# EAGLE design cpu3.5e2 (EAGLE 7.3.0)

## Sheet 1 of 2
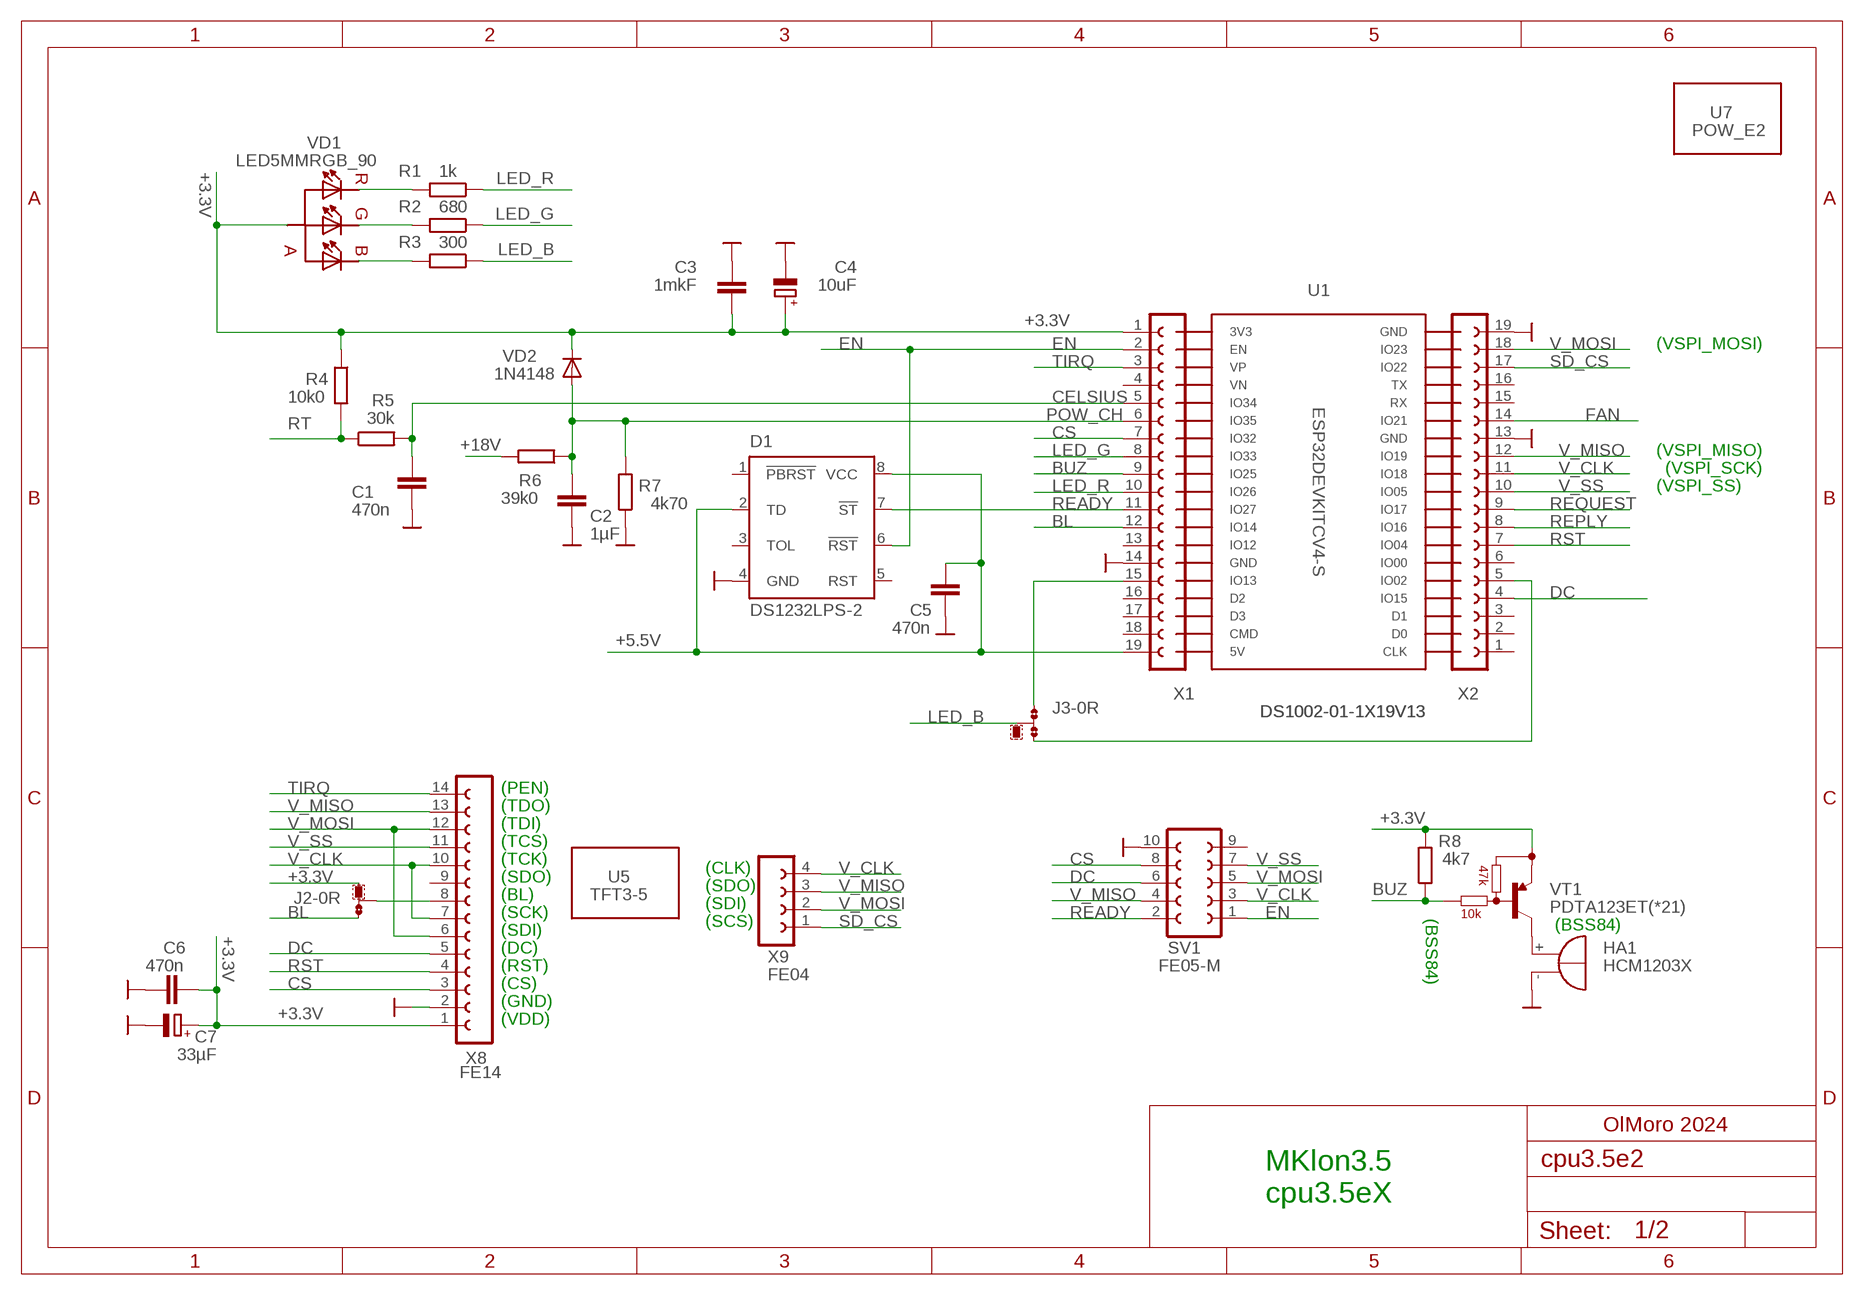
[diagram p0: schematic, sheet 1]

### Parts
C1  470n  C-EUC0805  [C0805]
C2  1µF  C-EUC0805  [C0805]
C3  1mkF  C-EUC0805  [C0805]
C4  10uF  CPOL-EUCT3528  [CT3528]
C5  470n  C-EUC0805  [C0805]
C6  470n  C-EUC0805  [C0805]
C7  33µF  CPOL-EUCT6032  [CT6032]
D1  DS1232LPS-2  [SO-08]
HA1  HCM1203X  BMT1205XH7.5  [BMT1205XH7.5]
J2  0R-JUMPB  [B0R-JMP]
J3  0R-JUMPB  [B0R-JMP]
R1  1k  R-EU_R0805  [R0805]
R2  680  R-EU_R0805  [R0805]
R3  300  R-EU_R0805  [R0805]
R4  10k0  R-EU_R0805  [R0805]
R5  30k  R-EU_R0805  [R0805]
R6  39k0  R-EU_R0805  [R0805]
R7  4k70  R-EU_R0805  [R0805]
R8  4k7  R-EU_R0805  [R0805]
SV1  FE05-M  [FE05-2M]
U1  ESP32DEVKITCV4-S  [ESP32DEVKITCV4-S]
U5  TFT3-5  [TFT3-5]
U7  POW_E2  POW3_5  [POW3_5]
VD1  LED5MMRGB_90  [LED5MMRGB_90]
VD2  1N4148  DIODE-MINIMELF  [MINIMELF]
VT1  PDTA123ET(*21)  BCR185  [SOT23-BEC]
X1  DS1002-01-1X19V13  [DS1002-01-1X19V13]
X2  DS1002-01-1X19V13  [DS1002-01-1X19V13]
X8  FE14  [FE14]
X9  FE04  [FE04]

### Nets
+3.3V: C3.1 C4.+ C6.1 C7.+ J2.1 R4.1 R8.2 VD1.P$3(A) VD2.C VT1.E X1.1 X8.1
+5.5V: C5.1 D1.2(TD) D1.8(VCC) X1.19 ; also sheet 2
+18V: R6.2 ; also sheet 2
BL: J2.3 X1.12
BUZ: R8.1 VT1.B X1.9
CELSIUS: C1.1 R5.2 X1.5
CS: SV1.8 X1.7 X8.3
DC: SV1.6 X2.4 X8.5
EN: D1.6(!RST) SV1.1 X1.2 ; also sheet 2
FAN: X2.14 ; also sheet 2
GND: C1.2 C2.2 C3.2 C4.- C5.2 C6.2 C7.- D1.4(GND) HA1.- R7.1 SV1.10 X1.14 X2.13 X2.19 X8.2 ; supply symbol labelled  ; also sheet 2
LED_B: J3.2 J3.3 R3.1 X1.15
LED_G: R2.1 X1.8
LED_R: R1.1 X1.10
N$1: J2.2 X8.8
N$3: J3.1 X2.5
N$14: HA1.+ VT1.C
N$39: R2.2 VD1.P$2(GREEN)
N$40: R1.2 VD1.P$4(RED)
N$44: R3.2 VD1.P$1(BLUE)
POW_CH: C2.1 R6.1 R7.2 VD2.A X1.6
READY: D1.7(!ST) SV1.2 X1.11 ; also sheet 2
REPLY: X2.8 ; also sheet 2
REQUEST: X2.9 ; also sheet 2
RST: X2.7 X8.4
RT: R4.2 R5.1 ; also sheet 2
SD_CS: X2.17 X9.1
TIRQ: X1.3 X8.14
V_CLK: SV1.3 X2.11 X8.7 X8.10 X9.4
V_MISO: SV1.4 X2.12 X8.13 X9.3
V_MOSI: SV1.5 X2.18 X8.6 X8.12 X9.2
V_SS: SV1.7 X2.10 X8.11
Unconnected: D1.1(!PBRST) D1.3(TOL) D1.5(RST) SV1.9 X1.4 X1.13 X1.16 X1.17 X1.18 X2.1 X2.2 X2.3 X2.6 X2.15 X2.16 X8.9

### Notes on the sheet
- (VSPI_MOSI)
- (VSPI_MISO)
- (VSPI_SCK)
- (VSPI_SS)
- (PEN)
- (TDO)
- (TDI)
- (TCS)
- (TCK)
- (CLK)
- (SDO)
- (SDO)
- (BL)
- (SDI)
- (SCK) | (BSS84) | (BSS84)
- (SCS)
- (SDI)
- (DC)
- (RST)
- (CS)
- (GND)
- (VDD)
- OlMoro 2024
- MKlon3.5
  cpu3.5eX

## Sheet 2 of 2
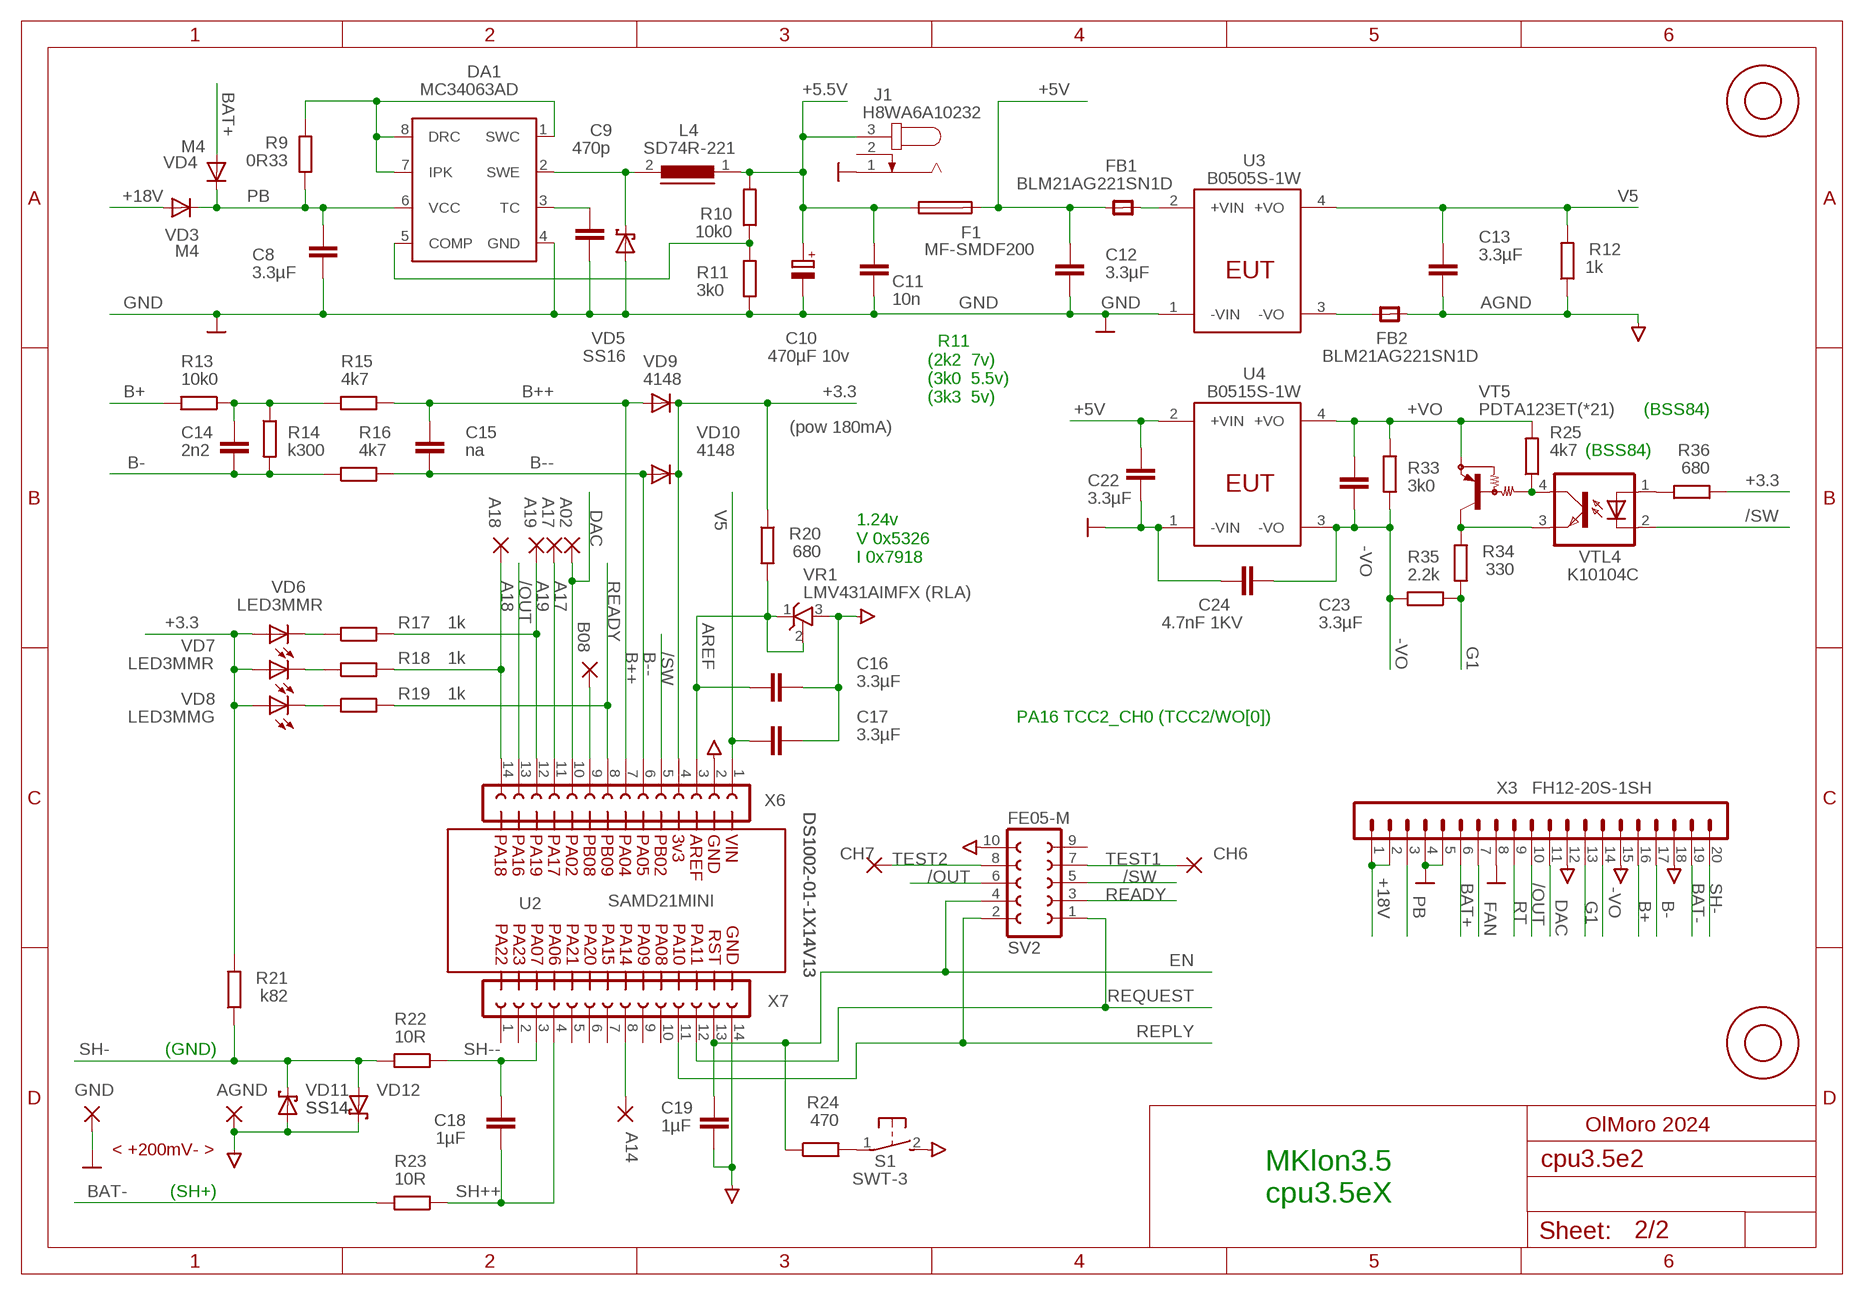
[diagram p1: schematic, sheet 2]

### Parts
A02  WIREPAD1,6/0,8  [1,6/0,8]
A14  WIREPAD1,6/0,8  [1,6/0,8]
A17  WIREPAD1,6/0,8  [1,6/0,8]
A18  WIREPAD1,6/0,8  [1,6/0,8]
A19  WIREPAD1,6/0,8  [1,6/0,8]
AGND  AGND  WIREPAD4,16O1,6  [4,16O1,6]
B08  WIREPAD1,6/0,8  [1,6/0,8]
C8  3.3µF  C-EUC0805  [C0805]
C9  470p  C-EUC0805  [C0805]
C10  470µF 10v  CPOL-EUE5-8.5  [E5-8,5]
C11  10n  C-EUC0805  [C0805]
C12  3.3µF  C-EUC0805  [C0805]
C13  3.3µF  C-EUC0805  [C0805]
C14  2n2  C-EUC0805  [C0805]
C15  na  C-EUC0805  [C0805]
C16  3.3µF  C-EUC0805  [C0805]
C17  3.3µF  C-EUC0805  [C0805]
C18  1µF  C-EUC0805  [C0805]
C19  1µF  C-EUC0805  [C0805]
C22  3.3µF  C-EUC0805  [C0805]
C23  3.3µF  C-EUC0805  [C0805]
C24  4.7nF 1KV  C-EU050-024X044  [C050-024X044]
CH6  WIREPAD1,6/0,8  [1,6/0,8]
CH7  WIREPAD1,6/0,8  [1,6/0,8]
DA1  MC34063AD  [SO08]
F1  MF-SMDF200  [MF-SMDF050]
FB1  BLM21AG221SN1D  FERRITE0805  [0805]
FB2  BLM21AG221SN1D  FERRITE0805  [0805]
GND  GND  WIREPAD4,16O1,6  [4,16O1,6]
J1  H8WA6A10232  JACK-PLUG0  [SPC4077]
L4  SD74R-221  DR74  [DR74]
R9  0R33  R-EU_R0805  [R0805]
R10  10k0  R-EU_R0805  [R0805]
R11  3k0  R-EU_R0805  [R0805]
R12  1k  R-EU_R0805  [R0805]
R13  10k0  R-EU_R0805  [R0805]
R14  k300  R-EU_R0805  [R0805]
R15  4k7  R-EU_R0805  [R0805]
R16  4k7  R-EU_R0805  [R0805]
R17  1k  R-EU_R0805  [R0805]
R18  1k  R-EU_R0805  [R0805]
R19  1k  R-EU_R0805  [R0805]
R20  680  R-EU_R0805  [R0805]
R21  k82  R-EU_R0805  [R0805]
R22  10R  R-EU_R0805  [R0805]
R23  10R  R-EU_R0805  [R0805]
R24  470  R-EU_R0805  [R0805]
R25  4k7  R-EU_R0805  [R0805]
R33  3k0  R-EU_R0805  [R0805]
R34  330  R-EU_R0805  [R0805]
R35  2.2k  R-EU_R0805  [R0805]
R36  680  R-EU_R0805  [R0805]
S1  SWT-3  31-XX  [B3F-31XX]
SV2  FE05-M  [FE05-2M]
U2  SAMD21MINI  [SAMD21MINI]
U3  B0505S-1W  HLK-1D1212  [HLK-1D1212]
U4  B0515S-1W  HLK-1D1212  [HLK-1D1212]
U$6  M3X20  [M3X20]
U$15  M3X20  [M3X20]
U$16  M3X20  [M3X20]
U$18  M3X20  [M3X20]
U$19  M3X12  [M3X12]
U$21  M3X12  [M3X12]
U$23  M3X12  [M3X12]
U$27  M3X12  [M3X12]
VD3  M4  DIODE-DO214AC  [DO214AC]
VD4  M4  DIODE-DO214AC  [DO214AC]
VD5  SS16  [DO214AC]
VD6  LED3MMR  [LED3MMR]
VD7  LED3MMR  [LED3MMR]
VD8  LED3MMG  [LED3MMG]
VD9  4148  DIODE-MINIMELF  [MINIMELF]
VD10  4148  DIODE-MINIMELF  [MINIMELF]
VD11  SS14  SS16  [DO214AC]
VD12  SS14  SS16  [DO214AC]
VR1  LMV431AIMFX (RLA)  TL431-SOT23-3  [SOT23]
VT5  PDTA123ET(*21)  MUN2113T1  [SC59-BEC]
VTL4  K10104C  SFH618A-3X007  [SMD4-7]
X3  FH12-20S-1SH  [FH12-20S-1SH]
X6  DS1002-01-1X14V13  [DS1002-01-1X14V13]
X7  DS1002-01-1X14V13  [DS1002-01-1X14V13]

### Nets
+3.3: R20.1 R21.2 R36.1 VD6.A VD7.A VD8.A VD9.C VD10.C X6.4
+5.5V: C10.+ C11.1 F1.1 J1.3 L4.1 R10.2 ; also sheet 1
+5V: C12.1 C22.2 F1.2 FB1.1 U4.2(+VIN)
+18V: VD3.A X3.1 X3.2 ; also sheet 1
+VO: C23.2 R25.2 R33.2 U4.4(+VO) VT5.E
-VO: C23.1 C24.2 R33.1 R35.2 U4.3(-VO) X3.14
/OUT: SV2.6 X3.10 X6.13
/SW: SV2.5 VTL4.2(C) X6.5
A17: A17.1(P) X6.11
A18: A18.1(P) R18.2 X6.14
A19: A19.1(P) R17.2 X6.12
AGND: AGND.1(P) C13.2 C16.2 C17.2 C19.2 FB2.2 R12.1 S1.2(S) SV2.10 VD11.A VD12.C VR1.3(A) X3.12 X3.15 X3.18 X6.2 X7.14
AREF: C16.1 R20.2 VR1.1(C) VR1.2(R) X6.3
B+: R13.2 X3.16
B++: C15.1 R15.2 VD9.A X6.7
B-: C14.2 R14.2 R16.1 X3.17
B--: C15.2 R16.2 VD10.A X6.6
BAT+: VD4.A X3.6
BAT-: R23.2 X3.19
DAC: A02.1(P) X3.11 X6.10
EN: C19.1 R24.1 SV2.4 X7.13 ; also sheet 1
FAN: X3.7 ; also sheet 1
G1: R34.1 R35.1 X3.13
GND: C8.2 C9.2 C10.- C11.2 C12.2 C22.1 C24.1 DA1.4(GND) GND.1(P) J1.1 R11.1 U3.1(-VIN) U4.1(-VIN) VD5.A X3.4 X3.5 X3.8 ; supply symbol labelled  ; also sheet 1
N$2: A14.1(P) X7.8
N$4: B08.1(P) X6.9
N$7: R18.1 VD7.K(C)
N$8: R17.1 VD6.K(C)
N$9: R19.1 VD8.K(C)
N$42: R34.2 VT5.C VTL4.3(EMIT)
N$45: R25.1 VT5.B VTL4.4(COL)
N$61: DA1.1(SWC) DA1.7(IPK) DA1.8(DRC) R9.2
N$62: DA1.2(SWE) L4.2 VD5.C
N$63: R24.2 S1.1(P)
N$68: C9.1 DA1.3(TC)
N$75: DA1.5(COMP) R10.1 R11.2
N$76: R36.2 VTL4.1(A)
N$80: C14.1 R13.1 R14.1 R15.1
N$81: FB1.2 U3.2(+VIN)
N$82: FB2.1 U3.3(-VO)
PB: C8.1 DA1.6(VCC) R9.1 VD3.C VD4.C X3.3
READY: R19.2 SV2.3 X6.8 ; also sheet 1
REPLY: SV2.2 X7.11 ; also sheet 1
REQUEST: SV2.1 X7.12 ; also sheet 1
RT: X3.9 ; also sheet 1
SH++: C18.1 R23.1 X7.4
SH-: R21.1 R22.2 VD11.C VD12.A X3.20
SH--: C18.2 R22.1 X7.3
TEST1: CH6.1(P) SV2.7
TEST2: CH7.1(P) SV2.8
V5: C13.1 C17.1 R12.2 U3.4(+VO) X6.1
Unconnected: J1.2 SV2.9 X7.1 X7.2 X7.5 X7.6 X7.7 X7.9 X7.10

### Notes on the sheet
- R11
  (2k2  7v)
  (3k0  5.5v)
  (3k3  5v)
- (BSS84)
- (pow 180mA)
- (BSS84)
- 1.24v
  V 0x5326
  I 0x7918
- PA16 TCC2_CH0 (TCC2/WO[0])
- (GND)
- OlMoro 2024
- < +200mV- >
- (SH+)
- MKlon3.5
  cpu3.5eX

## Library data of the parts
A02 A14 A17-A19 AGND B08 CH6 CH7 GND = wirepad:WIREPAD: Wire PAD connect wire on PCB
C1-C3 C5 C6 C8 C9 C11-C19 C22-C24 = rcl_moro:C-EU: CAPACITOR, European symbol
C4 C7 C10 = rcl_moro:CPOL-EU: POLARIZED CAPACITOR, European symbol
D1 = texas_moro:DS1232LP: Low Power MicroMonitor Chip Source: DALLAS SEMICONDUCTOR .. 1232lp.pdf; MF: DALLAS SEMICONDUCTOR; MPN: DS1232LPS-2; OC_FARNELL: 9724877; OC_NEWARK: 06F4304
DA1 = v-reg-3:MC34063A: 1.5A Step-Up/Down/Inverting Switching Regulator NPN Darlington Switch, Vin 3V to 40V, Current Limiter Input, adjustable Frequency up to 100kHz
F1 = fuse_moro:MF-SMDF: MF-SMDF Series - PRC Resettable Fuses Source: http://www.farnell.com/datasheets/716597.pdf
FB1 FB2 = microbuilder_v2:FERRITE: Ferrite Bead 0603 MMZ1608B121C - 120 Ohm @ 100MHz, 600mA, 0.15 Ohm DC Resistance - Digikey: 445-2164-1-ND BK1608HW121-T - 120 Ohm, 600mA Ferrite Chip - Digikey: 587-1876-2-ND 0805 HZ0805B272R-10 - 2.7K Ohm @ 100MHz, 200mA, 0.8 Ohm DC Resistance - Digikey: 240-2504-1-ND (see also Murata BLM21BD272SN1L) MMZ2012Y152B - 1.5K Ohm @ 100MHz, 500mA, 0.4 Ohm DC Resistance - Digikey: 445-1560-1-ND - Mainly for high frequency (80-400MHz) MMZ2012R102A - 1K Ohm @ 100MHz, 500mA, 0.3 Ohm DC Resistance - Digikey: 445-1555-2-ND - More general purpose (10-200MHz)
HA1 = buzzer-moro:BMT1205XH7.5: MAGNETIC TRANSDUCER Source: Http:www.be-star.com; OC_FARNELL: unknown; OC_NEWARK: unknown
J1 = con-jack:JACK-PLUG: DC POWER JACK Power Jack, DC, Right Angle, Through Hole, Rated 5A at 16VDC, PC Terminals Distributor: Farnell (www.Farnell.de) Drawing: 84N1161.pdf / 84N1162.pdf Manufacturer: SPC Technology (www.spctechnology.com) Type: SPC4077 / SPC 4078; OC_FARNELL: unknown; OC_NEWARK: unknown
J2 J3 = jump-0r-smd:0R-JUMP: SMD 0R 0805 Jumper
L4 = inductors:DR74: High Power Density, High Efficiency, Shielded Inductors Source: coiltronics_dr_series.pdf
R1-R25 R33-R36 = rcl_moro:R-EU_: RESISTOR, European symbol
S1 = switch-omron:31-XX: OMRON SWITCH; MPN: B3F-3100; OC_FARNELL: 959704; OC_NEWARK: 36M3582
SV1 SV2 = con-lsta_moro:FE05-M
U1 = MKlon:ESP32DEVKITCV4-S
U2 = Q921:SAMD21MINI
U3 U4 = wx-d21:HLK-1D1212
U5 = moro2:TFT3-5
U7 = MKlon:POW3_5
U$6 U$15 U$16 U$18 = MKlon:M3X20
U$19 U$21 U$23 U$27 = MKlon:M3X12
VD1 = MKlon:LED5MMRGB_90
VD2-VD4 VD9 VD10 = diode:DIODE-: DIODE
VD5 VD11 VD12 = diode-1:SS16
VD6 VD7 = led:LED3MMR
VD8 = led:LED3MMG
VR1 = moro4:TL431-SOT23-3
VT1 = digital-transistors:BCR185: PNP Silicon Digital Transistor 50V 0,1A 0,2W
VT5 = transistor-pnp:MUN2113*: PNP Bias Resistor Transistor
VTL4 = optocoupler:SFH618?*: Optocoupler, Phototransistor Output, Low Input Current Source: Data sheet <http://www.vishay.com/docs/83673/sfh618.pdf>; OC_FARNELL: unknown; OC_NEWARK: unknown
X1 X2 = MKlon:DS1002-01-1X19V13
X3 = wx-d21:FH12-20S-1SH
X6 X7 = MKlon:DS1002-01-1X14V13
X8 = con-lsta_moro:FE14
X9 = con-lsta_moro:FE04

## Board
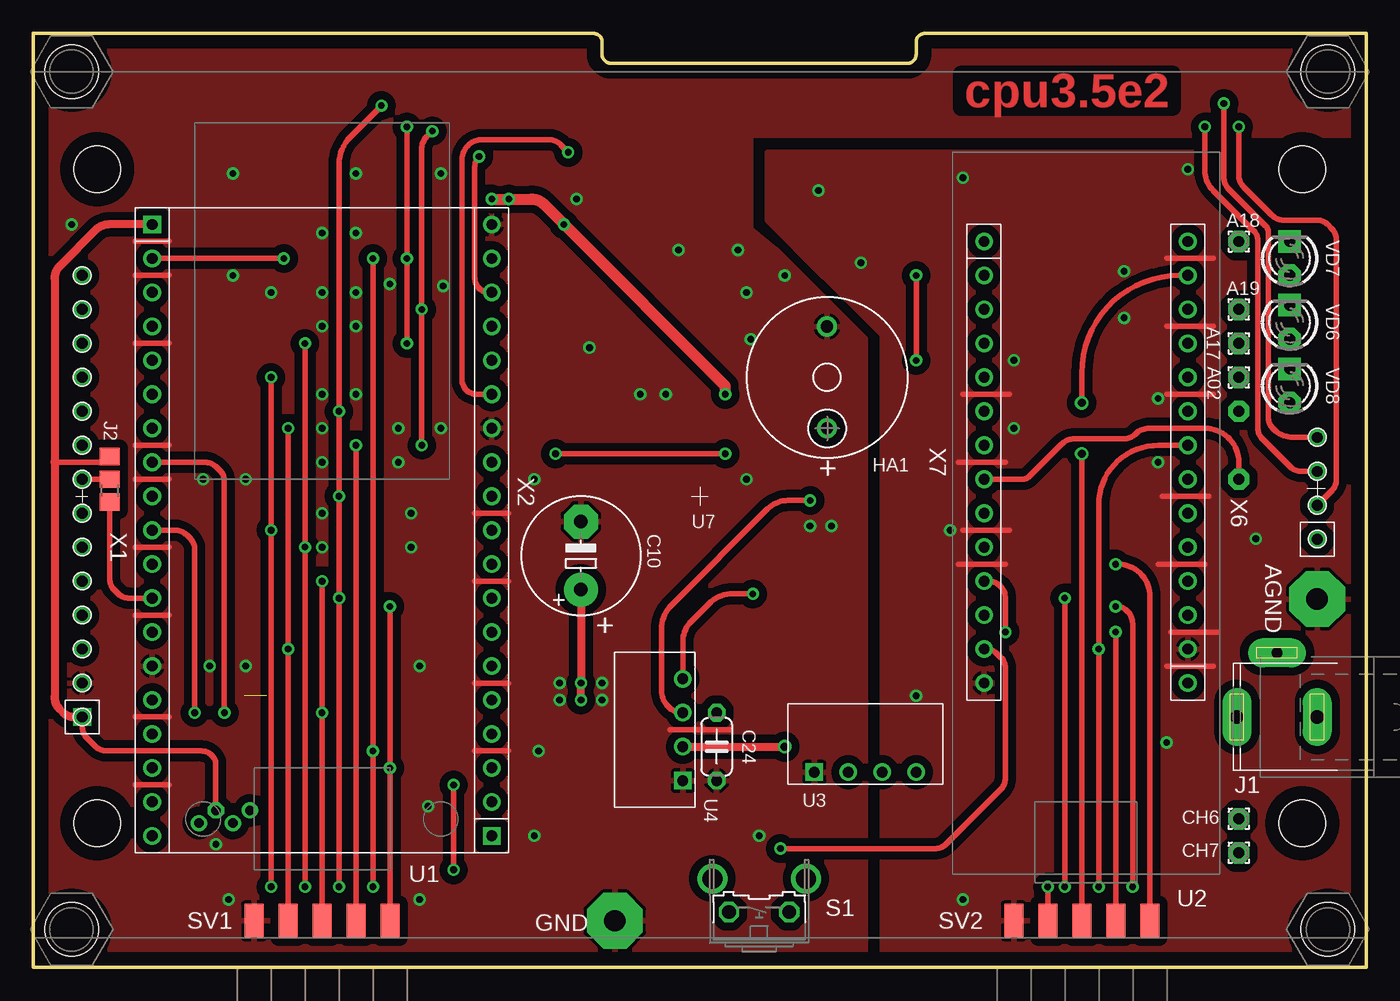
[diagram p2: board, top side]
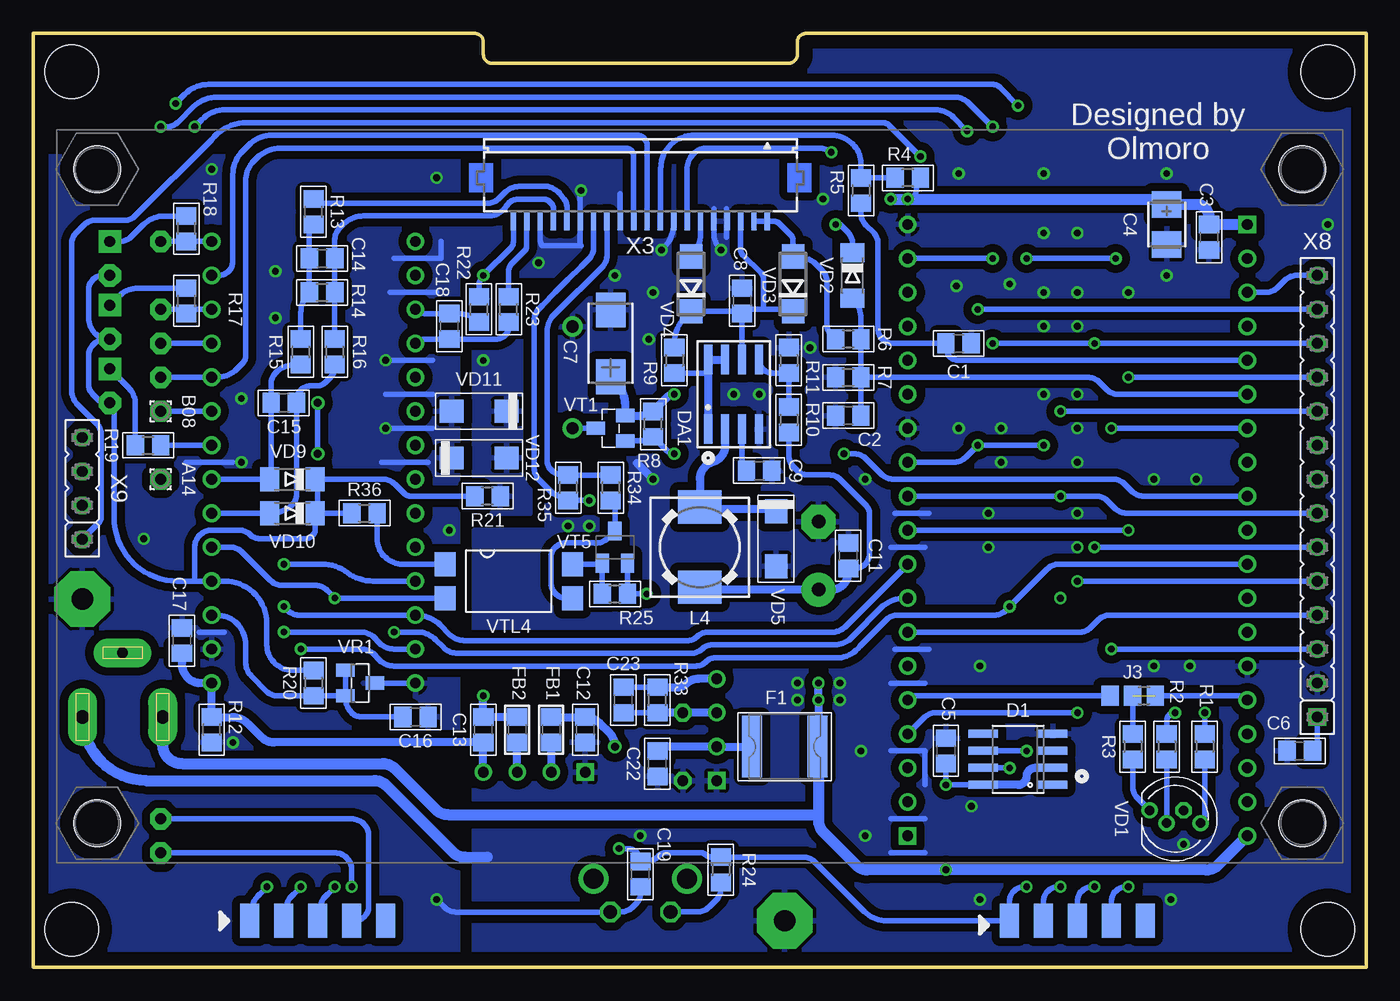
[diagram p3: board, bottom side, seen from below]

Size 99.69 x 69.85 mm. Coordinates in mm from the lower left corner, seen from the top.
Outline: 0,0 99.69,0 99.69,69.85 66.68,69.85 arc90 66.04,69.22 66.04,68.26 arc-90 65.4,67.63 43.18,67.63 arc-90 42.54,68.26 42.54,69.22 arc90 41.91,69.85 0,69.85 0,0
Copper layers (1*16): Top 0.035mm / dielectric 1.5mm / Bottom 0.035mm
Design rules "MKlon_E": minimum track width 16mil, minimum drill 19mil, track to track 12mil, track to pad 12mil, pad to pad 12mil, via to via 12mil, smd to smd 12mil, copper to edge 40mil, drill to drill 8mil, minimum pad ring 10mil, minimum via ring 8mil, stop-mask expansion 4mil, vias tented up to drill 0mil, thermal gap 10mil
Holes 4 mm at 96.84,66.99 96.84,2.86 2.86,2.86 2.86,66.99
bRestrict: 6 lines

### Footprints (pad centres in the part's own frame; a part is rotated, then mirrored left to right if it is on the bottom)
1,6/0,8 = drill 0.813 pad 1.6 octagon: 1 0,0
4,16O1,6 = drill 1.6 pad 4.166 octagon: 1 0,0
C0805 = smd 1.3 x 1.5: 1 -0.95,0; 2 0.95,0
CT3528 = smd 2 x 2.2: + 1.5,0; - -1.5,0
CT6032 = smd 2.6 x 2.2: + 2.5,0; - -2.5,0
E5-8,5 = drill 1.016 pad 2.54: + -2.54,0 | drill 1.016 pad 2.54 octagon: - 2.54,0
C050-024X044 = drill 0.813 octagon: 1 -2.54,0; 2 2.54,0
SO-08 = smd 0.6 x 2.2: 1 -1.905,-2.6; 2 -0.635,-2.6; 3 0.635,-2.6; 4 1.905,-2.6; 5 1.905,2.6; 6 0.635,2.6; 7 -0.635,2.6; 8 -1.905,2.6
SO08 = smd 0.6 x 2.2: 1 -1.905,-2.6; 2 -0.635,-2.6; 3 0.635,-2.6; 4 1.905,-2.6; 5 1.905,2.6; 6 0.635,2.6; 7 -0.635,2.6; 8 -1.905,2.6
MF-SMDF050 = smd 1.5 x 4.6: 1 -2.45,0; 2 2.45,0
0805 = smd 1.3 x 1.5: 1 -0.95,0; 2 0.95,0
BMT1205XH7.5 = drill 0.9 pad 1.5: + 3.8,0; - -3.8,0
SPC4077 = drill 1 pad 2.184 long: 1 -3,0; 3 3,0 | drill 0.8 pad 2.184 long: 2 0,-4.8
B0R-JMP = smd 1.5 x 1.3: 1 0,1.7; 2 0,0; 3 0,-1.7
DR74 = smd 2.5 x 3.25: 1 -3,0; 2 3,0
R0805 = smd 1.3 x 1.5: 1 -0.95,0; 2 0.95,0
B3F-31XX = drill 1.016 octagon: 1 -2.261,-1.245; 2 2.261,-1.245 | drill 1.499 pad 2.159: 3 -3.505,1.245; 4 3.505,1.245
FE05-2M = smd 1.422 x 2.54 bottom: 1 5.08,1.27; 3 2.54,1.27; 5 0,1.27; 7 -2.54,1.27; 9 -5.08,1.27 | smd 1.422 x 2.54: 2 5.08,1.27; 4 2.54,1.27; 6 0,1.27; 8 -2.54,1.27; 10 -5.08,1.27
HLK-1D1212 = drill 0.8 square: 1 -3.81,0 | drill 0.8: 2 -1.27,0; 3 1.27,0; 4 3.81,0
TFT3-5 = hole 3.5: -45.085,-24.448; 45.085,-24.448; 45.085,24.448; -45.085,24.448
LED5MMRGB_90 = drill 0.7: P$1 -1.905,0.635; P$2 -0.635,-0.318; P$4 1.905,-0.318 | drill 0.7 octagon: P$3 0.635,0.635
MINIMELF = smd 1.4 x 1.8: A 1.7,0; C -1.7,0
DO214AC = smd 1.8 x 1.7: A 2.05,0; C -2.05,0
LED3MMR = drill 0.813 pad 1.676 octagon: A -1.27,0 | drill 0.813 pad 1.676 square: K 1.27,0
LED3MMG = drill 0.813 pad 1.676 octagon: A -1.27,0 | drill 0.813 pad 1.676 square: K 1.27,0
SOT23 = smd 1 x 1.4: 1 -0.95,-1.1; 2 0.95,-1.1; 3 0,1.1
SOT23-BEC = smd 1 x 1.4: B -0.95,-1.1; C 0,1.1; E 0.95,-1.1
SC59-BEC = smd 1 x 1.4: B -0.95,-1.2; C 0,1.2; E 0.95,-1.2
SMD4-7 = smd 1.78 x 1.55: 1 -1.27,-4.77; 2 1.27,-4.77; 3 1.27,4.77; 4 -1.27,4.77
DS1002-01-1X19V13 = drill 0.813 square: 1 -22.86,0 | drill 0.813: 2 -20.32,0; 3 -17.78,0; 4 -15.24,0; 5 -12.7,0; 6 -10.16,0; 7 -7.62,0; 8 -5.08,0; 9 -2.54,0; 10 0,0; 11 2.54,0; 12 5.08,0; 13 7.62,0; 14 10.16,0; 15 12.7,0; 16 15.24,0; 17 17.78,0; 18 20.32,0; 19 22.86,0
FH12-20S-1SH = smd 0.406 x 1.321: 1 9.5,-3.25; 2 8.5,-3.25; 3 7.5,-3.25; 4 6.5,-3.25; 5 5.5,-3.25; 6 4.5,-3.25; 7 3.5,-3.25; 8 2.5,-3.25; 9 1.5,-3.25; 10 0.5,-3.25; 11 -0.5,-3.25; 12 -1.5,-3.25; 13 -2.5,-3.25; 14 -3.5,-3.25; 15 -4.5,-3.25; 16 -5.5,-3.25; 17 -6.5,-3.25; 18 -7.5,-3.25; 19 -8.5,-3.25; 20 -9.5,-3.25
DS1002-01-1X14V13 = drill 0.813: 1 -16.51,0; 2 -13.97,0; 3 -11.43,0; 4 -8.89,0; 5 -6.35,0; 6 -3.81,0; 7 -1.27,0; 8 1.27,0; 9 3.81,0; 10 6.35,0; 11 8.89,0; 12 11.43,0; 13 13.97,0; 14 16.51,0
FE14 = drill 0.813 square: 1 -16.51,0 | drill 0.813: 2 -13.97,0; 3 -11.43,0; 4 -8.89,0; 5 -6.35,0; 6 -3.81,0; 7 -1.27,0; 8 1.27,0; 9 3.81,0; 10 6.35,0; 11 8.89,0; 12 11.43,0; 13 13.97,0; 14 16.51,0
FE04 = drill 0.8 octagon: 1 -3.81,0; 2 -1.27,0; 3 1.27,0; 4 3.81,0

### Placement (x,y rotation side)
A02  90.17,44.13 180 top
A14  90.17,36.51 270 bottom
A17  90.17,46.67 180 top
A18  90.17,54.29 180 top
A19  90.17,49.21 180 top
AGND  96.04,27.55 90 top
B08  90.17,41.59 180 bottom
C1  30.48,46.67 0 bottom
C2  38.73,41.27 180 bottom
C3  11.75,54.61 270 bottom
C4  14.92,55.56 90 bottom
C5  31.43,16.19 90 bottom
C6  4.96,16.19 180 bottom
C7  56.52,46.67 270 bottom
C8  46.67,49.85 90 bottom
C9  45.4,37.15 0 bottom
C10  40.96,30.8 90 top
C11  38.73,30.8 90 bottom
C12  58.42,17.78 270 bottom
C13  66.04,17.78 90 bottom
C14  78.1,53.02 0 bottom
C15  80.96,42.23 0 bottom
C16  71.12,18.73 0 bottom
C17  88.58,24.45 90 bottom
C18  68.58,47.94 90 bottom
C19  54.29,6.98 270 bottom
C22  53.02,15.24 90 bottom
C23  55.56,20 90 bottom
C24  51.12,16.51 90 top
CH6  90.17,11.11 0 top
CH7  90.17,8.57 0 top
D1  26.03,15.56 90 bottom
DA1  47.31,42.86 0 bottom
F1  43.5,16.51 180 bottom
FB1  60.96,17.78 270 bottom
FB2  63.5,17.78 90 bottom
GND  43.5,3.49 180 top
HA1  59.37,44.13 270 top
J1  93.03,18.73 180 top
J2  5.71,36.51 0 top
J3  17.46,20.32 90 bottom
L4  49.85,31.43 90 bottom
R1  12.06,16.51 270 bottom
R2  14.92,16.51 270 bottom
R3  17.46,16.51 270 bottom
R4  34.29,59.05 180 bottom
R5  37.78,58.1 270 bottom
R6  38.73,46.99 180 bottom
R7  38.73,44.13 0 bottom
R8  53.34,40.64 90 bottom
R9  51.75,45.4 270 bottom
R10  43.18,40.96 270 bottom
R11  43.18,45.4 270 bottom
R12  86.36,17.78 90 bottom
R13  78.74,56.52 90 bottom
R14  78.1,50.48 0 bottom
R15  79.69,46.04 270 bottom
R16  77.15,46.04 270 bottom
R17  88.26,49.85 270 bottom
R18  88.26,55.24 270 bottom
R19  91.12,39.05 0 bottom
R20  78.74,21.27 270 bottom
R21  65.72,35.24 180 bottom
R22  66.36,49.21 90 bottom
R23  64.13,49.21 90 bottom
R24  48.26,7.3 270 bottom
R25  56.2,27.94 0 bottom
R33  53.02,20 90 bottom
R34  56.52,35.88 270 bottom
R35  59.69,35.88 270 bottom
R36  74.93,33.97 0 bottom
S1  54.29,5.4 0 top
SV1  21.59,2.22 0 top
SV2  78.42,2.22 0 top
U1  21.59,32.7 90 top
U2  78.74,33.97 270 top
U3  62.23,14.6 0 top
U4  48.58,17.78 90 top
U5  49.85,35.24 0 top
U7  49.85,34.61 0 top
U$6  2.86,2.86 0 top
U$15  2.86,66.99 0 top
U$16  96.84,2.86 0 top
U$18  96.84,66.99 0 top
U$19  4.76,10.79 0 bottom
U$21  4.76,59.69 0 bottom
U$23  94.93,10.79 0 bottom
U$27  94.93,59.69 0 bottom
VD1  14.29,11.11 0 bottom
VD2  38.42,51.75 270 bottom
VD3  42.86,51.12 90 bottom
VD4  50.48,51.12 90 bottom
VD5  44.13,32.07 270 bottom
VD6  93.98,48.26 90 top
VD7  93.98,53.02 90 top
VD8  93.98,43.5 90 top
VD9  80.33,36.51 180 bottom
VD10  80.33,33.97 180 bottom
VD11  66.36,41.59 180 bottom
VD12  66.36,38.1 0 bottom
VR1  75.25,21.27 270 bottom
VT1  56.52,40.32 90 bottom
VT5  56.2,31.43 0 bottom
VTL4  64.13,28.89 270 bottom
X1  8.89,32.7 270 top
X2  34.29,32.7 90 top
X3  54.29,59.05 0 bottom
X6  86.36,37.78 90 top
X7  71.12,37.78 270 top
X8  3.65,35.24 90 bottom
X9  96.04,35.83 90 bottom

### Tracks (layer width: path | path; a pad name or v marks a point on that pad's centre or on a via)
+3.3
  Bottom 0.406: 87.63,28.89 X6.4 85.41,28.89 arc90 82.23,25.72 82.23,24.13 arc-90 80.33,22.22 R20.1 | VD10.C 78.42,34.18 78.42,36.51 | 87.63,28.89 87.63,31.43 arc90 86.36,32.7 84.27,32.7 arc45 83.5,32.38 arc-45 82.74,32.07 79.37,32.07 arc-45 78.83,32.29 78.74,32.38 arc-45 78.63,32.66 VD10.C | R21.2 71.44,35.24 arc45 71.98,35.47 72.65,36.14 arc-45 73.55,36.51 78.42,36.51 | R36.1 VD10.C | VD6.A 94.3,46.99 | 94.3,46.99 arc77 95.57,48.58 95.57,50.67 arc45 95.25,51.44 arc45 94.48,51.75 VD7.A | 94.3,46.99 arc-90 95.57,45.72 95.57,43.63 arc-45 95.25,42.86 94.99,42.6 arc-45 94.41,42.23 VD8.A arc45 93.66,41.46 93.66,33.65 arc-90 88.9,28.89 87.63,28.89 | 78.42,36.51 VD9.C
+3.3V  (via drill 0.5, 0.51)
  Top 0.406: VD1.P$3 13.65,15.11 arc45 13.33,15.87 arc45 12.57,16.19 5.49,16.19 arc-45 4.59,16.56 4.02,17.13 arc-45 3.65,18.03 X8.1 | 1.96,19.31 2.22,19.05 | J2.1 arc-45 5.64,38.02 5.4,37.78 1.59,37.78
  Top 0.61: X1.1 5.61,55.56 arc45 4.71,55.19 1.96,52.44 arc45 1.59,51.54 1.59,37.78 1.59,20.21 arc45 1.96,19.31 | X8.1 2.99,18.73 arc-45 2.22,19.05
  Top 0.813: v51.75,42.86 51.75,43.5 v39.69,55.56 38.15,57.1 arc45 37.26,57.47 v35.56,57.47 v34.29,57.47
  Bottom 0.406: R4.1 33.66,59.05 33.66,58.1 arc90 v34.29,57.47 | VD2.C 38.42,54.16 arc-45 38.73,54.93 39.37,55.56 v39.69,55.56 | C6.1 arc-45 3.65,17.06 X8.1
  Bottom 0.61: X1.1 arc45 X1.1 | C3.1 11.75,55.75 | 15.85,57.47 arc45 14.96,57.1 C4.+ | v51.75,42.86 arc-45 52.29,42.64 R8.2 arc45 54.11,41.27 VT1.E 55.41,42.04 arc-45 56.15,43.8 C7.+
  Bottom 0.813: X1.1 C3.1 11.75,56.07 arc-45 12.07,56.83 arc-45 12.62,57.06 C4.+ | v35.56,57.47 v34.29,57.47 15.85,57.47
+5.5V  (via drill 0.5, 0.51)
  Top 0.406: v31.43,7.3 v31.43,13.65
  Top 0.61: v40.96,20 v40.96,21.27 C10.+
  Bottom 0.406: J1.3 90.03,17.32 | C5.1 v31.43,13.65 D1.8 | R10.2 43.18,38.31 arc-45 42.81,37.41 42.54,37.15 arc-45 41.78,36.83 40.14,36.83 arc45 39.37,36.51 37.37,34.52 arc45 37.15,33.97 37.15,30.93 arc45 37.46,30.16 arc45 38.23,29.85 C11.1
  Bottom 0.61: D1.2 24.77,14.92 arc-90 25.4,14.29 arc90 26.04,13.65 D1.8 | v40.96,21.27 v40.96,20 40.96,16.73 | J1.3 90.03,16.68 | C11.1 38.73,29.53 arc90 40.01,28.26 C10.+ 49.43,28.26 arc45 L4.1
  Bottom 0.813: 90.03,16.68 arc-90 88.58,15.24 73.55,15.24 arc45 72.65,14.87 69.59,11.8 arc-45 68.69,11.43 40.96,11.43 | X1.19 11.06,7.67 arc45 11.96,7.3 v31.43,7.3 37.33,7.3 arc45 38.1,7.62 40.59,10.11 arc45 40.96,11 40.96,11.43 | 40.96,16.29 40.96,11.43
  Bottom 1.016: 40.96,16.29 arc-45 F1.1 arc-45 40.96,16.73
+5V  (via drill 0.6)
  Top 0.61: U4.2 v56.2,16.51
  Bottom 0.406: 52.7,16.51 C22.2
  Bottom 0.61: FB1.1 C12.1 arc45 57.33,18.28 56.65,17.59 arc45 v56.2,16.51 | F1.2 U4.2 52.7,16.51
+18V
  Bottom 0.406: X3.2 X3.1 44.32,55.8 arc45 43.87,55.62 43.05,54.8 arc45 42.86,54.35 VD3.A 42.72,53.02 42.12,53.02 arc45 41.22,52.65 40.69,52.12 arc45 40.32,51.23 40.32,47.89 arc-45 R6.2
+VO  (via drill 0.5)
  Top 0.406: v53.82,27.94 52.31,27.94 arc45 50.54,27.21 49.21,25.88 arc45 48.58,24.34 U4.4
  Bottom 0.406: C23.2 arc90 C23.2 R33.2 | VT5.E R25.2 v53.82,27.94
  Bottom 0.61: U4.4 49.96,21.59 arc-45 50.85,21.22 arc45 51.5,20.95 R33.2
-VO  (via drill 0.5)
  Top 0.406: v58.1,34.92 56.46,34.92 arc45 54.93,34.29 47.72,27.08 arc45 46.99,25.32 46.99,20.68 arc45 47.47,19.53 47.49,19.5 arc45 U4.3
  Bottom 0.406: v58.1,34.92 59.44,34.92 arc45 R35.2 59.69,35.24 60.12,35.24 arc45 61.01,35.61 61.86,36.46 arc45 62.23,37.36 62.23,48.37 arc45 61.86,49.27 61.6,49.53 arc4 58.74,52.39 58.16,52.96 arc-45 57.79,53.86 X3.14 | R33.1 C23.1
  Bottom 0.61: U4.3 C24.2 R33.1 arc45 R33.1
/OUT  (via drill 0.6)
  Top 0.406: X6.13 85.72,51.75 arc90 78.42,44.45 v78.42,42.23 | SV2.6 v78.42,38.42
  Bottom 0.406: v78.42,38.42 v78.42,42.23 | X3.10 53.79,61.28 arc-90 54.43,62.23 81.83,62.23 arc-45 83.6,61.5 84.04,61.06 arc-45 84.77,59.29 84.77,52.84 arc45 85.09,52.07 arc45 85.86,51.75 X6.13
/SW  (via drill 0.5)
  Top 0.406: v77.15,6.03 v77.15,27.62
  Bottom 0.406: VTL4.2 v77.15,27.62 77.73,28.2 arc-45 78.63,28.57 81.07,28.57 arc45 81.97,28.95 84.08,31.06 arc-45 84.98,31.43 X6.5 | SV2.5 78.42,3.73 arc45 77.69,5.49 v77.15,6.03
A17
  Bottom 0.406: X6.11 A17.1
A18
  Bottom 0.406: X6.14 87.49,54.29 arc45 R18.2 arc45 89.04,54.29 A18.1
A19
  Bottom 0.406: X6.12 87.75,49.21 arc-45 R17.2 88.26,49.21 A19.1
AGND  (via drill 0.51)
  Top 0.406: 87.95,35.24 84.46,35.24 | 88.26,42.86 84.77,42.86 | 88.26,47.94 84.77,47.94 | 88.26,53.02 84.77,53.02 | 87.63,30.16 84.14,30.16 | 88.58,25.08 85.09,25.08 | 88.26,22.54 84.77,22.54 | 72.71,37.78 69.21,37.78 | 73.02,42.86 69.53,42.86 | 72.71,30.16 69.21,30.16 | 73.02,32.7 69.53,32.7
  Bottom 0.406: VR1.3 X7.14 | v73.34,40.32 69.85,40.32 | 73.34,42.86 69.85,42.86 | v73.34,45.4 69.85,45.4 | 73.66,37.78 70.17,37.78 | 73.02,50.48 69.53,50.48 | 72.71,53.02 69.21,53.02 69.21,54.29 | v69.53,5.08 69.03,4.58 arc-45 67.95,4.13 56.61,4.13 arc-45 S1.2 55.75,4.15 arc-45 54.85,4.52 54.61,4.76 arc-45 54.29,5.53 C19.2 | v58.74,58.1 arc-45 58.79,57.97 X3.15 58.79,54.11 arc-45 58.74,53.97 61.6,53.97 arc45 61.79,54.45 X3.18 | 55.83,57.86 55.83,55.73 | 55.83,55.69 55.83,55.73 | 55.83,55.73 arc45 X3.12 | 88.26,37.78 84.77,37.78 | 87.31,25.08 85.41,25.08
  Bottom 0.61: FB2.2 C13.2 v66.04,20.32
  other vias: 68.58,32.7 81.6,52.07 81.6,48.58 91.44,32.07 84.77,16.83 69.53,59.05 61.91,52.7 84.14,42.54 84.14,37.78 86.36,59.69
  pour Bottom (isolate 0.61): 67.94,0.63 67.94,51.75 60.32,51.75 57.78,54.29 54.29,54.29 54.29,60.64 99.06,60.64 99.06,0.63
  pour Top (isolate 0.61): 63.5,0.63 99.06,0.63 99.06,60.96 54.93,60.96 54.93,55.88 63.5,47.31
AREF
  Bottom 0.406: VR1.2 R20.2 81.47,20.32 arc45 82.23,20.64 83.37,21.78 arc45 83.82,22.86 83.82,24.18 arc-45 84.46,25.72 arc-45 85.99,26.35 X6.3 | C16.1 75.12,18.73 arc45 75.88,19.05 arc45 76.35,20.17 VR1.2 | VR1.2 VR1.1
B+
  Bottom 0.406: X3.16 59.79,56.95 arc-45 60.01,57.47 arc-45 61.22,58.42 63.37,58.42 arc-45 64.61,57.78 64.7,57.69 arc45 65.56,57.15 77.98,57.15 arc45 R13.2
B++
  Bottom 0.406: X6.7 VD9.A arc-45 81.91,36.79 C15.1 81.91,43.69 arc45 81.6,44.45 arc45 80.06,45.09 R15.2
B-
  Bottom 0.406: R16.1 77.15,50.23 arc-45 R14.2 C14.2 77.16,54.34 arc45 76.74,55.34 76.52,55.56 arc45 74.98,56.2 65.4,56.2 arc-45 64.23,57.06 64.13,57.15 arc45 63.37,57.47 61.6,57.47 arc45 61.05,57.24 60.96,57.15 arc45 60.79,56.75 X3.17
B--
  Bottom 0.406: X6.6 VD10.A 81.86,33.97 arc-45 80.33,34.61 arc-45 80.01,35.37 C15.2 80.01,42.41 arc45 79.69,43.18 arc45 78.93,43.5 78.42,43.5 arc-45 77.88,43.72 77.47,44.13 arc-45 77.15,44.9 R16.2
BAT+
  Bottom 0.406: X3.6 49.79,54.83 arc45 VD4.A
BAT-
  Bottom 0.406: R23.2 64.13,52.12 arc45 63.95,52.57 62.98,53.54 arc-45 62.79,53.99 X3.19
BL
  Top 0.406: J2.3 5.71,29.02 arc45 6.03,28.26 6.3,27.99 arc45 7.19,27.62 X1.12
BUZ  (via drill 0.51)
  Top 0.406: v51.75,38.42 v39.05,38.42
  Bottom 0.406: v39.05,38.42 38.31,38.42 arc45 37.41,38.05 36.25,36.88 arc-45 35.35,36.51 18.94,36.51 arc45 18.04,36.14 17.52,35.61 arc-45 16.62,35.24 X1.9 | VT1.B 54.11,39.37 arc-45 R8.1 52.29,38.64 arc-45 v51.75,38.42
CELSIUS
  Bottom 0.406: X1.5 30.48,45.4 arc90 31.43,46.35 C1.1 35.43,46.67 arc45 36.2,46.99 arc45 36.51,47.76 36.51,54.16 arc-45 36.83,54.93 37.41,55.51 arc45 37.78,56.41 R5.2
CS  (via drill 0.51)
  Top 0.406: v19.05,40.32 v19.05,23.81 SV1.8
  Bottom 0.406: v19.05,40.32 X1.7 | X8.3 v19.05,23.81
DAC
  Bottom 0.406: A02.1 X6.10 85.99,44.13 arc-45 84.46,44.77 84.04,45.18 arc-45 83.82,45.72 83.82,58.79 arc45 83.18,60.32 82.96,60.55 arc45 81.2,61.28 55.43,61.28 arc90 54.79,60.64 X3.11
DC  (via drill 0.5, 0.51)
  Top 0.406: v21.59,28.89 v21.59,19.05 SV1.6
  Bottom 0.406: X8.5 v21.59,28.89 | v21.59,19.05 32.18,19.05 arc-45 33.07,18.68 X2.4
EN  (via drill 0.5, 0.51)
  Top 0.406: v25.4,53.02 v25.4,16.19 v25.4,6.03 | v55.88,8.89 67.42,8.89 arc45 68.32,9.26 72.34,13.28 arc45 72.71,14.18 72.71,22.41 arc45 72.39,23.18 72.13,23.44 arc45 71.23,23.81 X7.13 | X1.2 v18.73,53.02 | SV2.4 v80.96,25.08
  Bottom 0.406: v80.96,25.08 75.25,25.08 arc53 73.98,24.45 arc-53 72.71,23.81 X7.13 | D1.6 v25.4,16.19 | v18.73,53.02 v25.4,53.02 | v25.4,6.03 25.59,6.03 arc-45 26.35,5.71 arc-45 26.67,4.95 SV1.1 35.85,3.49 arc45 37.52,4.18 41.22,7.88 arc-45 42.12,8.25 R24.1 arc-45 R24.1 48.98,8.25 arc45 49.37,8.41 arc-45 49.75,8.57 52.39,8.57 arc-45 52.93,8.35 53.02,8.25 arc45 53.8,7.93 C19.1 arc-90 55.25,8.89 v55.88,8.89
FAN  (via drill 0.5)
  Top 0.406: X2.14 33.15,42.86 arc-45 32.39,43.18 arc-45 32.07,43.95 32.07,60.32 arc-90 33.5,61.91 38.63,61.91 arc-45 39.56,61.41 v40.01,60.96
  Bottom 0.406: v40.01,60.96 arc-37 40.96,61.28 49.53,61.28 arc-77 50.8,59.69 X3.7 arc-90 X3.7
G1
  Bottom 0.406: X3.13 56.79,53.27 arc45 57.16,52.37 60.59,48.95 arc-45 61.28,47.73 61.28,37.99 arc-90 60.11,36.83 R35.1 R34.1
GND  (via drill 0.51)
  Top 0.406: 33.02,21.27 35.56,21.27 | 33.02,28.89 35.56,28.89 | 33.02,33.97 35.56,33.97 | 33.02,16.19 35.56,16.19 | 7.62,39.05 10.16,39.05 | 7.62,46.67 10.16,46.67 | 7.62,54.29 10.16,54.29 | 7.62,51.75 10.16,51.75 | 7.62,31.43 10.16,31.43 | 7.62,26.35 10.16,26.35 | 7.62,18.73 10.16,18.73 | 7.62,13.65 10.16,13.65 | 47.62,17.78 52.07,17.78 | 7.62,36.51 10.16,36.51
  Bottom 0.406: 35.56,16.19 33.02,16.19 33.02,13.65 | 33.02,11.11 35.56,11.11 | 33.02,8.57 35.56,8.57 | X3.8 51.79,55.61 arc45 52.52,53.84 v52.7,53.66 | X3.5 48.79,54.94 arc-45 v48.26,53.66 | 47.84,55.49 47.84,54.63 | 47.84,56.76 47.84,55.9 arc-45 47.81,55.82 X3.4 | 48.79,56.76 48.79,55.9 | 33.02,31.43 35.56,31.43 | 32.7,33.97 35.24,33.97 | 32.7,23.81 35.24,23.81 | 33.02,21.27 35.56,21.27
  Bottom 0.61: 54.57,37.74 v53.34,36.51
  Bottom 0.813: J1.1 arc-88 91.28,13.97 74.19,13.97 arc45 73.29,13.6 68.32,8.63 arc-45 67.42,8.25 65.72,8.25
  other vias: 42.54,21.27 30.48,59.37 47.31,42.86 28.89,5.08 28.26,31.43 21.59,37.78 17.78,50.48 41.59,46.35 56.2,51.75 53.66,46.99 40.64,57.47 58.1,33.02 12.7,36.51 15.88,36.51 14.92,59.37 2.86,55.56 59.69,33.02 53.34,50.48 54.29,9.84 37.46,9.84 29.53,12.06 14.6,5.08 24.13,59.37 30.48,40.32 15.88,22.54 13.18,22.54 27.3,40.32 13.65,9.21 28.89,22.54 37.78,16.19 39.37,21.27 39.37,20 42.54,20 21.59,40.32 21.59,33.97 21.59,31.43 28.26,33.97 21.59,42.86 21.59,47.94 21.59,50.48 21.59,54.93 24.13,54.93 24.13,50.48 24.13,47.94 24.13,42.86 14.92,51.75 45.4,42.86 27.3,37.78 37.46,36.51 30.64,50.96 26.67,51.12
  pour Bottom (isolate 0.61): 0.63,69.22 41.91,69.22 41.91,66.99 66.67,66.99 66.67,69.22 99.06,69.22 99.06,62.23 53.02,62.23 53.18,53.02 56.83,53.02 61.28,48.58 61.28,32.7 66.67,32.7 66.67,0.63 0.63,0.63
  pour Top (isolate 0.61): 0.63,0.63 62.23,0.63 62.23,46.99 55.56,53.66 53.66,55.24 53.66,62.23 99.06,62.23 99.06,69.22 66.67,69.22 66.67,66.99 41.91,66.99 41.91,69.22 0.63,69.22
LED_B  (1 unrouted)
  Bottom 0.406: J3.2 R3.1 | J3.3 9.66,20.32 arc45 X1.15
LED_G  (via drill 0.5)
  Top 0.406: v14.29,19.05 14.29,36.38 arc45 13.97,37.15 13.71,37.41 arc45 12.81,37.78 X1.8
  Bottom 0.406: R2.1 14.92,18.41 arc90 v14.29,19.05
LED_R  (via drill 0.5)
  Top 0.406: v12.07,19.05 12.07,31.3 arc45 11.75,32.07 11.48,32.33 arc45 10.59,32.7 X1.10
  Bottom 0.406: v12.07,19.05 R1.1
N$1
  Top 0.406: X8.8 J2.2
N$2
  Top 0.406: X7.8 73.98,36.51 arc45 74.52,36.74 76.84,39.05 arc-45 77.76,39.53 81.62,39.53 arc45 82.55,40 arc-45 83.77,40.32 87.63,40.32 arc-90 90.17,37.78 A14.1
N$3
  Bottom 0.406: X2.5 34.2,20.09 arc45 33.66,20.32 J3.1
N$4
  Bottom 0.406: X6.9 B08.1
N$7
  Bottom 0.406: VD7.K 93.24,54.29 arc-45 92.34,54.66 91.44,55.56 arc45 89.91,56.19 R18.1
N$8
  Bottom 0.406: R17.1 arc-45 R17.1 91.87,50.8 arc-45 93.31,50.2 VD6.K
N$9
  Bottom 0.406: R19.1 92.07,42.14 arc-45 92.58,43.37 VD8.K
N$14
  Bottom 0.406: VT1.C 59.35,40.32 arc45 HA1.+
N$39
  Bottom 0.406: VD1.P$2 R2.2
N$40
  Bottom 0.406: R1.2 12.07,11.56 arc45 VD1.P$4
N$42
  Bottom 0.406: VTL4.3 59.88,27.62 arc45 60.64,27.94 arc45 60.96,28.71 60.96,30.8 arc45 60.74,31.34 60.64,31.43 arc45 59.88,31.75 57.79,31.75 arc-45 56.81,32.02 VT5.C 56.2,34.16 arc-45 R34.2
N$44
  Bottom 0.406: R3.2 17.46,13.54 arc-45 17.09,12.65 VD1.P$1
N$45
  Bottom 0.406: VTL4.4 57.15,30.16 VT5.B arc45 VT5.B R25.1
N$61
  Bottom 0.406: R9.2 49.22,44.45 arc45 49.21,44.45
  Bottom 0.61: DA1.7 47.94,45.4 49.15,45.4 DA1.8 49.21,44.45 DA1.1
N$62
  Bottom 0.406: 49.83,34.29 49.83,34.42 L4.2
  Bottom 0.61: 49.83,34.29 44.3,34.29 VD5.C | DA1.2 47.94,39.05 arc74 48.89,37.78 arc-74 49.85,36.51 L4.2
N$63
  Bottom 0.406: R24.2 48.26,5.92 arc45 48.63,5.03 49.13,4.52 arc45 50.03,4.15 S1.1
N$68
  Bottom 0.406: DA1.3 46.67,37.92 arc-45 C9.1
N$75
  Bottom 0.406: DA1.5 arc-90 44.39,44.45 R11.2 R10.1
N$76
  Bottom 0.406: VTL4.1 72.07,30.16 arc90 73.98,32.07 R36.2 arc-45 R36.2
N$80
  Bottom 0.406: R13.1 arc-45 79.05,54.8 C14.1 R14.1 arc-45 79.69,48.94 R15.1
N$81
  Bottom 0.61: FB1.2 U3.2
N$82
  Bottom 0.61: U3.3 FB2.1
PB
  Bottom 0.406: VD3.C 42.86,49.21 45.08,49.21 | C8.1 46.36,49.21 45.08,49.21 | DA1.6 C8.1 | C8.1 arc-90 46.84,49.07 | 45.08,49.21 45.08,51.49 arc-45 45.27,51.94 46.61,53.27 arc45 46.79,53.72 X3.3 | R9.1 51.75,46.76 arc45 51.02,48.53 VD4.C 47.08,49.07 arc45 C8.1
POW_CH
  Bottom 0.406: R7.2 R6.1 37.79,48.53 arc-45 VD2.A | R7.2 C2.1 | X1.6 18.52,42.86 arc45 19.42,43.23 19.95,43.76 arc-45 20.85,44.13 R7.2
READY  (via drill 0.5, 0.51)
  Top 0.406: v79.69,6.03 v79.69,23.81 79.69,34.61 arc-90 84.14,39.05 X6.8 | v26.67,26.99 v26.67,14.92 SV1.2
  Bottom 0.406: D1.7 v26.67,14.92 | v79.69,23.81 75.25,23.81 arc53 73.98,23.18 arc-53 72.71,22.54 50.14,22.54 arc-45 49.37,22.86 arc45 48.6,23.18 39.26,23.18 arc-45 37.73,24.18 35.93,25.98 arc45 35.03,26.35 27.83,26.35 arc-45 26.93,26.72 v26.67,26.99 23.87,29.79 arc45 22.97,30.16 X1.11 | X6.8 R19.2 | SV2.3 80.96,3.73 arc45 80.23,5.49 v79.69,6.03
REPLY  (via drill 0.5, 0.51)
  Top 0.406: v80.96,30.16 arc-90 83.5,27.94 SV2.2 | v72.71,25.08 72.71,27.62 arc90 71.44,28.89 X7.11
  Bottom 0.406: X7.11 74.3,28.89 arc37 76.2,29.53 arc-37 78.11,30.16 v80.96,30.16 | v72.71,25.08 70.96,25.08 arc45 69.61,24.52 69.03,23.94 arc-45 67.95,23.49 50.46,23.49 arc-45 49.69,23.81 arc45 48.92,24.13 39.58,24.13 arc-45 38.36,24.82 36.29,26.89 arc45 34.52,27.62 X2.8
REQUEST  (via drill 0.5, 0.51)
  Top 0.406: v82.23,6.03 82.23,25.72 arc74 81.28,26.99 v80.96,26.99
  Bottom 0.406: X2.9 39,25.45 arc45 39.9,25.08 49.24,25.08 arc-45 50.01,24.76 arc45 50.77,24.45 67.47,24.45 arc45 68.55,24.9 69.28,25.62 arc-45 71.04,26.35 X7.12 79.8,26.35 arc45 80.7,26.72 v80.96,26.99 | SV2.1 83.5,3.73 arc45 82.77,5.49 v82.23,6.03
RST
  Bottom 0.406: X2.7 21.4,25.08 arc-45 20.64,25.4 20.06,25.98 arc45 19.16,26.35 X8.4
RT
  Bottom 0.406: X3.9 52.79,59.34 arc10 52.7,60.32 arc71 50.48,62.23 39.95,62.23 arc45 38.42,61.59 38.38,61.56 arc45 37.78,60.12 R5.1 arc45 37.54,59.05 R4.2
SD_CS  (via drill 0.5)
  Top 0.406: v33.34,60.64 arc45 33.02,59.88 33.02,51.57 arc45 33.34,50.8 arc45 34.1,50.48 X2.17
  Bottom 0.406: X9.1 94.82,33.24 arc-45 94.61,33.74 94.61,39.8 arc-45 94.99,40.69 96.47,42.17 arc45 96.84,43.39 96.84,54.08 arc45 96.47,54.98 95.94,55.51 arc45 95.04,55.88 92.84,55.88 arc-45 92.07,56.2 86.36,61.91 arc45 84.01,63.18 36.2,63.18 arc45 35.65,62.96 v33.34,60.64
SH++
  Bottom 0.406: R23.1 64.13,47.94 arc90 65.09,46.99 68.48,46.99 arc90 C18.1 70.35,46.99 arc-45 X7.4
SH-  (via drill 0.5)
  Top 0.406: v66.04,45.4 v66.04,51.75
  Bottom 0.406: X3.20 63.79,54.26 arc45 63.98,53.81 v66.04,51.75 arc-45 66.36,50.99 R22.2
  pour Bottom (isolate 0.61): 62.55,33.97 66.67,33.97 66.67,49.85 62.55,49.85
SH--
  Bottom 0.406: X7.3 arc-45 70.35,48.89 C18.2 67.88,48.89 arc45 R22.1
TEST1
  Bottom 0.406: CH6.1 75.88,11.11 arc90 74.61,9.84 74.61,4.44 arc90 SV2.7
TEST2  (via drill 0.5)
  Top 0.406: SV2.8 v75.88,6.03
  Bottom 0.406: CH7.1 77.15,8.57 arc90 75.88,7.3 v75.88,6.03
TIRQ
  Bottom 0.406: X8.14 5.19,51.75 arc-45 6.09,51.38 6.61,50.85 arc45 7.51,50.48 X1.3
V5
  Bottom 0.406: C13.1 66.35,16.83 arc-45 66.36,16.83
  Bottom 0.61: U3.4 C13.1 | C17.1 88.58,22.86 arc-90 87.31,21.27 X6.1 R12.2 84.8,18.73 arc45 83.66,18.26 82.6,17.2 arc-45 81.71,16.83 66.36,16.83
V_CLK  (via drill 0.5, 0.51)
  Top 0.406: v89.06,64.61 89.06,59.1 arc45 89.43,58.21 92.17,55.47 arc-45 92.39,54.93 92.39,41.09 arc45 92.71,40.32 92.8,40.24 arc45 94.24,39.64 X9.4 | v22.86,6.03 v22.86,27.62 v22.86,35.24 v22.86,41.59 22.86,60.12 arc-45 23.87,62.28 v26.04,64.45
  Bottom 0.406: X8.10 v22.86,41.59 | X2.11 v22.86,35.24 20.21,35.24 arc45 19.31,34.87 18.79,34.34 arc-45 17.89,33.97 X8.7 | SV1.3 24.13,4.95 arc45 23.81,5.71 arc45 23.05,6.03 v22.86,6.03 | v89.06,64.61 88.36,65.31 arc45 86.59,66.04 27.94,66.04 arc45 27.4,65.81 v26.04,64.45
V_MISO  (via drill 0.5, 0.51)
  Top 0.406: v87.63,62.86 87.63,59.64 arc45 88.26,58.1 91.23,55.14 arc-45 91.6,54.4 91.6,40.45 arc45 91.92,39.53 93.97,37.47 arc45 94.87,37.1 X9.3 | v29.05,39.05 v29.05,49.21 29.05,61.23 arc-45 29.42,62.13 v29.84,62.55 | SV1.4 v24.13,39.05
  Bottom 0.406: X8.13 v29.05,49.21 | v24.13,39.05 v29.05,39.05 29.95,38.15 arc45 30.85,37.78 X2.12 | v87.63,62.86 87.09,63.4 arc45 85.32,64.13 32.23,64.13 arc45 30.87,63.57 v29.84,62.55
V_MOSI  (via drill 0.5)
  Top 0.406: v27.94,46.67 v27.94,53.02 v27.94,62.86 | v20.32,6.03 v20.32,31.43 v20.32,46.67 | v90.17,62.86 90.17,59.26 arc45 90.54,58.37 92.66,56.25 arc45 93.55,55.88 96.07,55.88 arc-45 96.84,55.56 97.1,55.3 arc-45 97.47,54.4 97.47,36.51 arc-45 97.1,35.62 X9.2
  Bottom 0.406: X8.12 v20.32,46.67 v27.94,46.67 | v27.94,53.02 X2.18 | X8.6 v20.32,31.43 | SV1.5 21.59,4.95 arc45 21.27,5.71 arc45 20.51,6.03 v20.32,6.03 | v90.17,62.86 89.74,62.86 arc-45 88.85,63.24 87.73,64.35 arc45 85.96,65.09 30.8,65.09 arc45 29.71,64.64 v27.94,62.86 27.94,62.92
V_SS  (via drill 0.5)
  Top 0.406: v17.78,6.03 v17.78,32.7 v17.78,44.13
  Bottom 0.406: v17.78,32.7 X2.10 | v17.78,44.13 X8.11 | SV1.7 19.05,4.95 arc45 18.73,5.71 arc45 17.97,6.03 v17.78,6.03

### Text on the board
Top: cpu3.5e2
tPlace: + | +
bPlace: Designed by / Olmoro